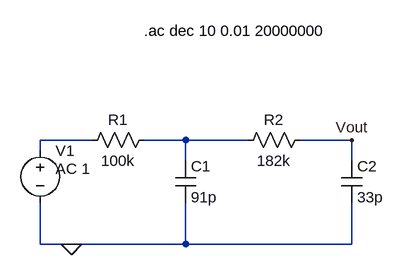
[diagram p0: schematic circuito_1.asc]
circuito_1.asc, the LTspice schematic file:
Version 4.1
SHEET 1 880 680
WIRE 80 112 0 112
WIRE 224 112 160 112
WIRE 320 112 224 112
WIRE 480 112 400 112
WIRE 0 128 0 112
WIRE 224 144 224 112
WIRE 480 144 480 112
WIRE 0 272 0 208
WIRE 48 272 0 272
WIRE 224 272 224 208
WIRE 224 272 48 272
WIRE 480 272 480 208
WIRE 480 272 224 272
FLAG 48 272 0
FLAG 480 112 Vout
SYMBOL voltage 0 112 R0
WINDOW 3 24 44 Left 2
WINDOW 123 0 0 Left 0
WINDOW 39 0 0 Left 0
SYMATTR Value AC 1
SYMATTR InstName V1
SYMBOL cap 208 144 R0
SYMATTR InstName C1
SYMATTR Value 91p
SYMBOL cap 464 144 R0
SYMATTR InstName C2
SYMATTR Value 33p
SYMBOL res 176 96 R90
WINDOW 0 0 56 VBottom 2
WINDOW 3 32 56 VTop 2
SYMATTR InstName R1
SYMATTR Value 100k
SYMBOL res 416 96 R90
WINDOW 0 0 56 VBottom 2
WINDOW 3 32 56 VTop 2
SYMATTR InstName R2
SYMATTR Value 182k
TEXT 160 -56 Left 2 !.ac dec 10 0.01 20000000

The netlist it stands for:
* circuito_1.asc
V1 N001 0 AC 1
C1 N002 0 91p
C2 Vout 0 33p
R1 N002 N001 100k
R2 Vout N002 182k
.ac dec 10 0.01 20000000
.backanno
.end